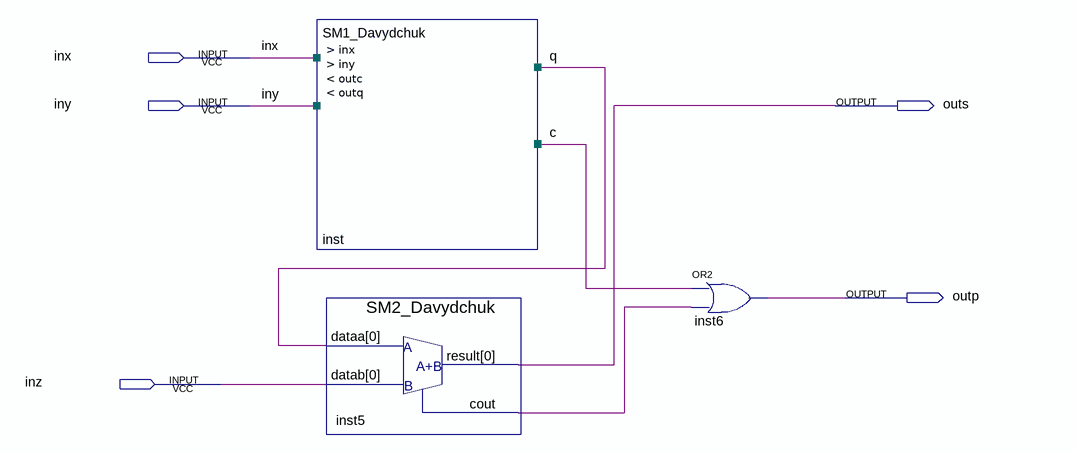
[diagram p0: schematic sheet]
// Quartus schematic CLProject_ArtemDavydchuk_v1.bdf as structural Verilog: 3 symbols, 5 pins
module CLProject_ArtemDavydchuk_v1 (
  input  inx,
  input  iny,
  input  inz,
  output outs,
  output outp
);

  wire c, inst5_cout, q;

  SM1_Davydchuk inst (.inx(inx), .iny(iny), .outc(c), .outq(q));
  SM2_Davydchuk inst5 (.dataa(q), .datab(inz), .result(outs), .cout(inst5_cout));
  or inst6 (outp, c, inst5_cout);
endmodule
